# Altium schematic sheet 直流无刷电机V2.0.SchDoc
size A3
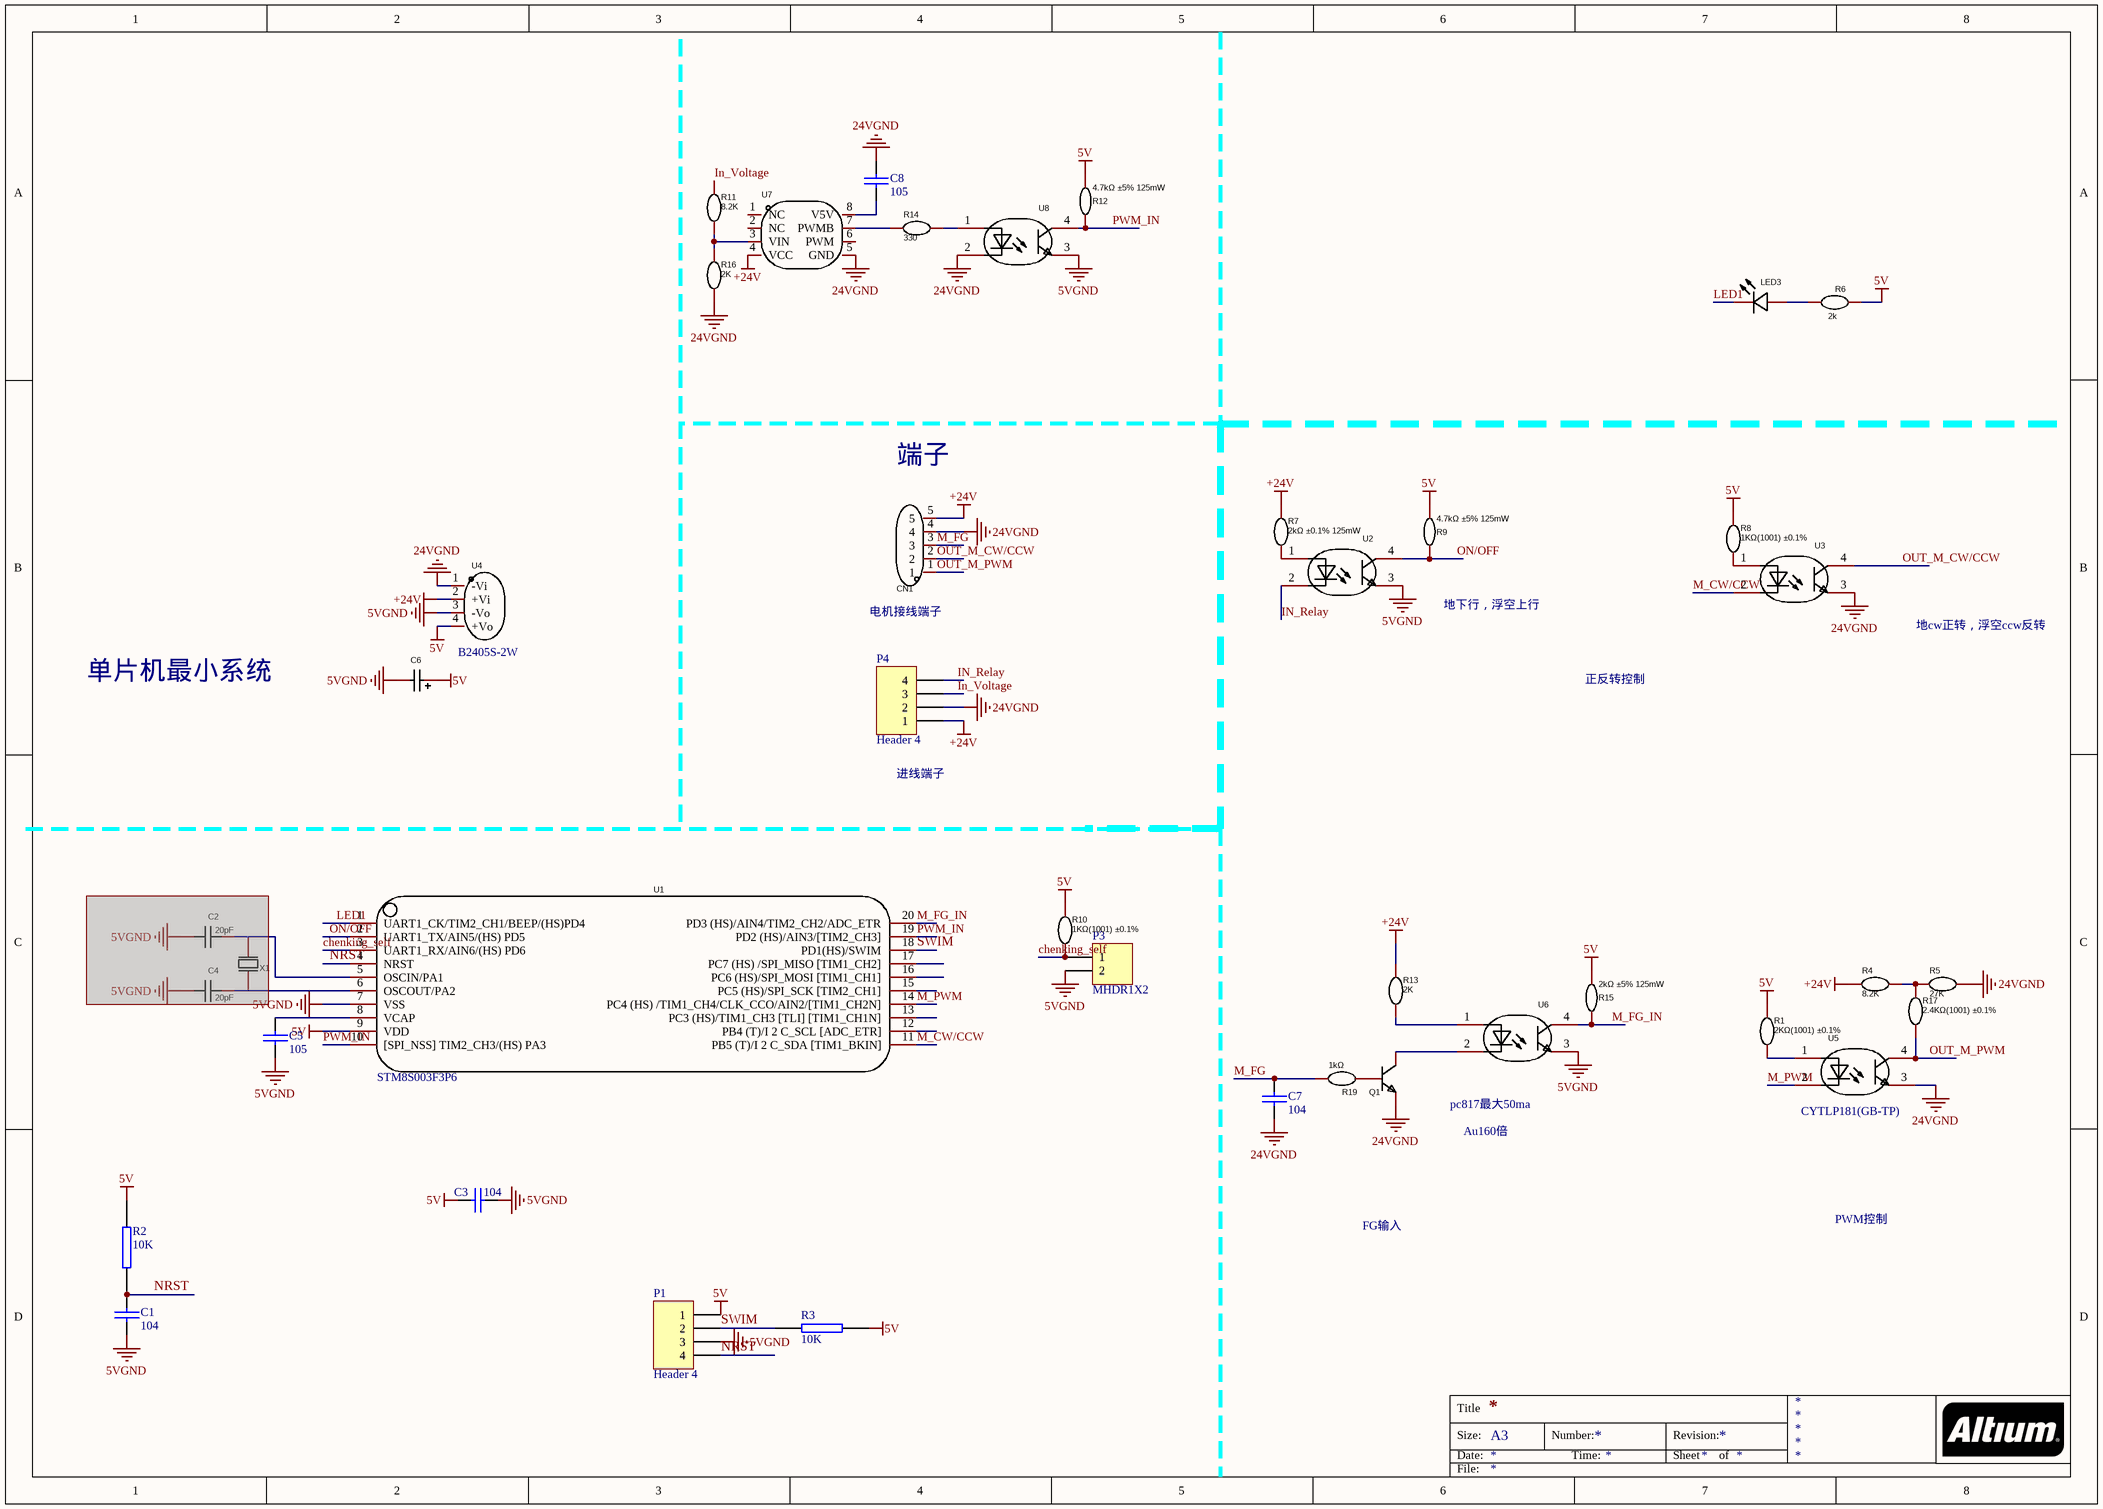
[diagram p0: 直流无刷电机V2.0.SchDoc]

## Parts
C1  104  [C0805]
C2  value 20pF  [C0805]  (hidden comment: 0805CG200J500NT)  (masked out: inside a compile mask, not in the netlist)
C3  104  [C0805]
C4  value 20pF  [C0805]  (hidden comment: 0805CG200J500NT)  (masked out: inside a compile mask, not in the netlist)
C5  105  [C0805]
C6  CA45-B010K476T  [CAP-SMD_L3.5-W2.8-R-RD]  (value not drawn)
C7  104  [C0805]
C8  105  [C0805]
CN1  DB2EVC-2.54-5P-GN  [CONN-TH_5P-P2.54_DIBO_DB2EVC-2.54-5P-GN]  (value not drawn)
LED3  17-21/R6C-AQ2R2B/3T  [LED0805-R-RD]  (value not drawn)
P1  Header 4  [HDR1X4]
P3  MHDR1X2  [MHDR1X2]
P4  Header 4  [CONN-TH_XY340V-3.81-3P]
Q1  BC817_C2137  [SOT-23-3_L2.9-W1.3-P1.90-LS2.4-BR]  (value not drawn)
R1  LCSC Part Name: 2KΩ(1001) ±0.1%  [R0805]  (hidden comment: ERJPB6B1001V)
R2  10K  [R0805]
R3  10K  [R0805]
R4  LCSC Part Name: 8.2K  [R0805]  (hidden comment: ERJPB6B1001V)
R5  LCSC Part Name: 27K  [R0805]  (hidden comment: ERJPB6B1001V)
R6  LCSC Part Name: 2k  [R0805]  (hidden comment: ERJPB6B1001V)
R7  LCSC Part Name: 2kΩ ±0.1% 125mW  [R0805]  (hidden comment: RN73H2ATTD2001B10)
R8  LCSC Part Name: 1KΩ(1001) ±0.1%  [R0805]  (hidden comment: ERJPB6B1001V)
R9  LCSC Part Name: 4.7kΩ ±5% 125mW  [R0805]  (hidden comment: RTT05472JTP)
R10  LCSC Part Name: 1KΩ(1001) ±0.1%  [R0805]  (hidden comment: ERJPB6B1001V)
R11  LCSC Part Name: 8.2K  [R0805]  (hidden comment: ERJPB6B1001V)
R12  LCSC Part Name: 4.7kΩ ±5% 125mW  [R0805]  (hidden comment: RTT05472JTP)
R13  LCSC Part Name: 2K  [R0805]  (hidden comment: ERJPB6B1001V)
R14  LCSC Part Name: 330  [R0805]  (hidden comment: RN73H2ATTD2001B10)
R15  LCSC Part Name: 2kΩ ±5% 125mW  [R0805]  (hidden comment: RTT05472JTP)
R16  LCSC Part Name: 2K  [R0805]  (hidden comment: ERJPB6B1001V)
R17  LCSC Part Name: 2.4KΩ(1001) ±0.1%  [R0805]  (hidden comment: ERJPB6B1001V)
R19  LCSC Part Name: 1kΩ  [R0805]  (hidden comment: 0805W8F8002T5E)
U1  STM8S003F3P6  [TSSOP-20_L6.5-W4.4-P0.65-LS6.4-BL]
U2  PC817C_C2936043  [SOP-4_L6.5-W4.6-P2.54-LS10.2-TL]  (value not drawn)
U3  PC817C_C2936043  [SOP-4_L6.5-W4.6-P2.54-LS10.2-TL]  (value not drawn)
U4  B2405S-2W  [PWRM-TH_B2405S-1WR2]
U5  CYTLP181(GB-TP)  [SOP-4_L3.9-W4.4-P2.54-LS7.0-BR]
U6  PC817C_C2936043  [SOP-4_L6.5-W4.6-P2.54-LS10.2-TL]  (value not drawn)
U7  GP9303-F500-N-SW  [SOP-8_L4.9-W3.9-P1.27-LS6.0-BL]  (value not drawn)
U8  PC817C_C2936043  [SOP-4_L6.5-W4.6-P2.54-LS10.2-TL]  (value not drawn)
X1  S1C80000ZWGAC  [HC-49S_L11.0-W4.7-P4.88]  (value not drawn)  (masked out: inside a compile mask, not in the netlist)

## Nets
5V: C3.1 C6.1 P1.1 R1.2 R2.1 R3.2 R6.2 R8.2 R9.2 R10.2 R12.2 R15.2 U1.9(VDD) U4.4(+Vo)
5VGND: C1.2 C3.2 C5.1 C6.2 P1.3 P3.2 U1.7(VSS) U2.3 U4.3(-Vo) U6.3 U8.3
24VGND: C7.1 C8.1 CN1.4 P4.2 Q1.2(E) R5.1 R16.1 U3.3 U4.1(-Vi) U5.3(EMI) U7.5(GND) U8.2
+24V: CN1.5 P4.1 R4.2 R7.2 R13.2 U4.2(+Vi) U7.4(VCC)
chenking_self: P3.1 R10.1 U1.3(UART1_RX/AIN6/(HS)_PD6)
IN_Relay: P4.4 U2.2
In_Voltage: P4.3 R11.2
LED1: LED3.1(K) U1.1(UART1_CK/TIM2_CH1/BEEP/(HS)PD4)
M_CW/CCW: U1.11(PB5_(T)/I_2_C_SDA_[TIM1_BKIN]) U3.2
M_FG: C7.2 CN1.3 R19.1
M_FG_IN: R15.1 U1.20(PD3_(HS)/AIN4/TIM2_CH2/ADC_ETR) U6.4
M_PWM: U1.14(PC4_(HS)_/TIM1_CH4/CLK_CCO/AIN2/[TIM1_CH2N]) U5.2(CAT)
NRST: C1.1 P1.4 R2.2 U1.4(NRST)
ON/OFF: R9.1 U1.2(UART1_TX/AIN5/(HS)_PD5) U2.4
OUT_M_CW/CCW: CN1.2 U3.4
OUT_M_PWM: CN1.1 R17.1 U5.4(COL)
PWM_IN: R12.1 U1.10([SPI_NSS]_TIM2_CH3/(HS)_PA3) U1.19(PD2_(HS)/AIN3/[TIM2_CH3]) U8.4
SWIM: P1.2 R3.1 U1.18(PD1(HS)/SWIM)
NetC5_2: C5.2 U1.8(VCAP)
NetC8_2: C8.2 U7.8(V5V)
NetLED3_2: LED3.2(A) R6.1
NetQ1_1: Q1.1(B) R19.2
NetQ1_3: Q1.3(C) U6.2
NetR1_1: R1.1 U5.1(AN)
NetR4_1: R4.1 R5.2 R17.2
NetR7_1: R7.1 U2.1
NetR8_1: R8.1 U3.1
NetR11_1: R11.1 R16.2 U7.3(VIN)
NetR13_1: R13.1 U6.1
NetR14_1: R14.1 U8.1
NetR14_2: R14.2 U7.7(PWMB)

Not connected (* = marked no-connect by the designer): U1 5(OSCIN/PA1) 6(OSCOUT/PA2) 12(PB4_(T)/I_2_C_SCL_[ADC_ETR]) 13(PC3_(HS)/TIM1_CH3_[TLI]_[TIM1_CH1N]) 15(PC5_(HS)/SPI_SCK_[TIM2_CH1]) 16(PC6_(HS)/SPI_MOSI_[TIM1_CH1]) 17(PC7_(HS)_/SPI_MISO_[TIM1_CH2]); U7 1(NC) 2(NC) 6(PWM)

## Notes on the sheet
- (near CN1) 端子
- (near CN1) 电机接线端子
- 地下行，浮空上行
- 地cw正转，浮空ccw反转
- 单片机最小系统
- 正反转控制
- (near P4) 进线端子
- pc817最大50ma
- Au160倍
- FG输入
- PWM控制
- Title
- Size:
- Date:
- A3
- Number:
- Time:
- Revision:
- Sheet
- of
- File:

## Library data of the parts
C1 C3 C5 C7 C8 = CAP: Capacitor
C2 C4 = 0805CG200J500NT: Manufacturer: FH(风华); Add into BOM: yes; Temperature Coefficient: C0G; Tolerance: ±5%; Voltage Rated: 50V; Name: 20pF; Symbol: 0805CG200J500NT; Device: 0805CG200J500NT; LCSC Part Name: 20pF(200) ±5% 50V; Supplier Part: C94472; Manufacturer Part: 0805CG200J500NT; Supplier Footprint: 0805; JLCPCB Part Class: Extended Part; Datasheet: https://atta.szlcsc.com/upload/public/pdf/source/20170923/C94472_1506149578159988997.pdf; Supplier: LCSC; Convert to PCB: yes
C6 = CA45-B010K476T: Manufacturer: 湘怡中元/湘江; Name: 47uF; Add into BOM: yes; Rated Voltage: 10V; Equivalent Series Resistance(ESR): 1Ω 100kHz; Value: 47uF; Tolerance: ±10%; Symbol: CA45-B010K476T; Device: CA45-B010K476T; LCSC Part Name: 47uF ±10% 10V; Supplier Part: C123253; Manufacturer Part: CA45-B010K476T; Supplier Footprint: CASE-B_3528; JLCPCB Part Class: Extended Part; Datasheet: https://atta.szlcsc.com/upload/public/pdf/source/20181017/C123253_E44F021CD80332E438026884F943F9F2.pdf; Supplier: LCSC; Convert to PCB: yes; Operating Temperature: -55℃~+125℃
CN1 = DB2EVC-2.54-5P-GN: Manufacturer: DIBO(地博电气); Add into BOM: yes; Connector Type: 板端/插座-闭口; Pitch: 2.54mm; Number of PINs Per Row: 5; Current Rating (Max): 5A; Voltage Rating (Max): 150V; Name: DB2EVC-2.54-5P-GN; Symbol: DB2EVC-2.54-5P-GN; Device: DB2EVC-2.54-5P-GN; LCSC Part Name: 板端/插座-闭口 2.54mm 排数:1 每排P数:5 直针; Supplier Part: C2927496; Manufacturer Part: DB2EVC-2.54-5P-GN; Supplier Footprint: 直插,P=2.54mm; JLCPCB Part Class: Extended Part; Datasheet: https://atta.szlcsc.com/upload/public/pdf/source/20211210/E15A577DC3E4D22CA3FDFA7356E87168.pdf; Supplier: LCSC; Convert to PCB: yes; Number of Rows: 1; Mounting Style: 直针; Contact Material: 铜合金; Contact Plating: 锡; Operating Temperature Range: -40℃~+105℃; Color: 绿色
LED3 = 17-21/R6C-AQ2R2B/3T: Manufacturer: EVERLIGHT(亿光); Add into BOM: yes; Illumination Color: 红色; Luminous Intensity (IF=20mA): 90~180mcd; Dominant Wavelength / Coordinate rank: 617.5~633.5nm; Name: 17-21/R6C-AQ2R2B/3T; Symbol: 17-21/R6C-AQ2R2B/3T; Device: 17-21/R6C-AQ2R2B/3T; LCSC Part Name: 17-21/R6C-AQ2R2B/3T; Supplier Part: C113551; Manufacturer Part: 17-21/R6C-AQ2R2B/3T; Supplier Footprint: 0805; JLCPCB Part Class: Extended Part; Datasheet: https://atta.szlcsc.com/upload/public/pdf/source/20170914/C113551_1505373979236968871.pdf; Supplier: LCSC; Convert to PCB: yes; Mounting Type: 表面贴装
P1 P4 = Header 4: Header, 4-Pin; LatestRevisionDate: 17-Jul-2002; LatestRevisionNote: Re-released for DXP Platform.; Publisher: Altium Limited
P3 = MHDR1X2: Header, 2-Pin; LatestRevisionDate: 17-Jul-2002; LatestRevisionNote: Re-released for DXP Platform.; Publisher: Altium Limited
Q1 = BC817_C2137: Manufacturer: CJ(江苏长电/长晶); Name: BC817; Symbol: BC817-16 6A; Add into BOM: yes; Transistor Type: NPN; Collector-Emitter Breakdown Voltage (Vceo): 45V; Collector Current (Ic): 500mA; Power Dissipation (Pd): 300mW; Collector Cut-Off Current (Icbo): 100nA; Collector-Emitter Saturation Voltage (VCE(sat)@Ic,Ib): 700mV@500mA,50mA; DC Current Gain (hFE@Ic,Vce): 100@100mA,1V; Transition Frequency (fT): 100MHz; Device: BC817_C2137; LCSC Part Name: NPN 45V 500mA; Supplier Part: C2137; Manufacturer Part: BC817; Supplier Footprint: SOT-23; JLCPCB Part Class: Extended Part; Datasheet: https://atta.szlcsc.com/upload/public/pdf/source/20140809/1457707208989.pdf; Supplier: LCSC; Convert to PCB: yes; Operating Temperature: +150℃@(Tj)
R1 R4-R6 R8 R10 R11 R13 R16 R17 = ERJPB6B1001V: Manufacturer: PANASONIC(松下); Add into BOM: yes; Name: ERJPB6B1001V; Symbol: ERJPB6B1001V; Device: ERJPB6B1001V; Supplier Part: C413712; Manufacturer Part: ERJPB6B1001V; Supplier Footprint: 0805; JLCPCB Part Class: Extended Part; Datasheet: https://atta.szlcsc.com/upload/public/pdf/source/20190821/C413712_16C6B59B4DECA51D4907C6F5D5BAEAA8.pdf; Supplier: LCSC; Convert to PCB: yes
R2 R3 = RES2
R7 R14 = RN73H2ATTD2001B10: Manufacturer: KOA; Name: 2kΩ; Add into BOM: yes; Value: 2kΩ; Tolerance: ±0.1%; Power(Watts): 125mW; Temperature Coefficient: ±10ppm/℃; Symbol: RN73H2ATTD2001B10; Device: RN73H2ATTD2001B10; Supplier Part: C782235; Manufacturer Part: RN73H2ATTD2001B10; Supplier Footprint: 0805; JLCPCB Part Class: Extended Part; Datasheet: https://atta.szlcsc.com/upload/public/pdf/source/20200909/C782235_A96C5D75DAB930F25D533550B4CBE346.pdf; Supplier: LCSC; Convert to PCB: yes
R9 R12 R15 = RTT05472JTP: Manufacturer: RALEC(旺诠); Name: 4.7kΩ; Add into BOM: yes; Value: 4.7kΩ; Tolerance: ±5%; Power(Watts): 125mW; Temperature Coefficient: ±100ppm/℃; Overload Voltage (Max): 150V; Symbol: RTT05472JTP; Device: RTT05472JTP; Supplier Part: C104350; Manufacturer Part: RTT05472JTP; Supplier Footprint: 0805; JLCPCB Part Class: Extended Part; Datasheet: https://atta.szlcsc.com/upload/public/pdf/source/20170408/1491646559888.pdf; Supplier: LCSC; Convert to PCB: yes; Type: 厚膜电阻; Operating Temperature Range: -55℃~+155℃
R19 = 0805W8F8002T5E: Manufacturer: UNI-ROYAL(厚声); Name: 80kΩ; Add into BOM: yes; Value: 80kΩ; Tolerance: ±1%; Power(Watts): 125mW; Temperature Coefficient: ±100ppm/℃; Overload Voltage (Max): 150V; Symbol: 0805W8F8002T5E; Device: 0805W8F8002T5E; Supplier Part: C2767534; Manufacturer Part: 0805W8F8002T5E; Supplier Footprint: 0805; JLCPCB Part Class: Extended Part; Datasheet: https://atta.szlcsc.com/upload/public/pdf/source/20200306/C422600_1E6D84923E4A46A82E41ADD87F860B5C.pdf; Supplier: LCSC; Convert to PCB: yes; Type: 厚膜电阻; Operating Temperature Range: -55℃~+155℃
U1 = STM8S003F3P6: Manufacturer: ST(意法半导体); Add into BOM: yes; Name: STM8S003F3P6; Symbol: STM8S003F3P6; Device: STM8S003F3P6; LCSC Part Name: STM8S003F3P6; Supplier Part: C18615; Manufacturer Part: STM8S003F3P6; Supplier Footprint: TSSOP-20; JLCPCB Part Class: Extended Part; Datasheet: https://atta.szlcsc.com/upload/public/pdf/source/20130903/1457706644298.pdf; Supplier: LCSC; Convert to PCB: yes
U2 U3 U6 U8 = PC817C_C2936043: Manufacturer: Slkor(萨科微); Name: PC817C; Add into BOM: yes; Input voltage type: DC; Output Type: 光电三极管; Number of Outputs: 1; Forward Voltage: 1.2V; Reverse Voltage: 6V; Output Current: 50mA; Receiving End Voltage: 70V; Collector-Emitter Saturation Voltage (Vce(sat)@Ic,IF): 100mV@1mA,20mA; Rise time: 4us@2mA,100Ω; Fall time: 3us@2mA,100Ω; Isolation Voltage(rms): 5kV; Symbol: PC817C_C2936043; Device: PC817C_C2936043; LCSC Part Name: PC817C; Supplier Part: C2936043; Manufacturer Part: PC817C; Supplier Footprint: SOP-4-2.54mm; JLCPCB Part Class: Extended Part; Datasheet: https://atta.szlcsc.com/upload/public/pdf/source/20211223/F034BA3A35BFF661DF174E965ECEB7BD.pdf; Supplier: LCSC; Convert to PCB: yes; Operating Temperature: -40℃~+100℃
U4 = B2405S-1W_C3345180: Manufacturer: NYBOXING(尼博星); Add into BOM: yes; Output Channel: 1; Input Voltage(DC): 21.6V~26.4V; Output Voltage: 5V; Output Power: 1W; Insulated Voltage: 1kV; Name: B2405S-1W; Symbol: B2405S-1W_C3345180; Device: B2405S-1W_C3345180; LCSC Part Name: 电源模块 模块电源 dcdc模块 24V转5V 1W 隔离模块; Supplier Part: C3345180; Manufacturer Part: B2405S-1W; Supplier Footprint: 插件; JLCPCB Part Class: Extended Part; Datasheet: https://atta.szlcsc.com/upload/public/pdf/source/20220704/F96432D0D6BB557B5DEFFC115F2CECD6.pdf; Supplier: LCSC; Convert to PCB: yes
U5 = CYTLP181(GB-TP): Manufacturer: OCIC(卓睿); Symbol: CYTLP181(GB-TP2); Add into BOM: yes; Name: CYTLP181(GB-TP); Device: CYTLP181(GB-TP); LCSC Part Name: CYTLP181(GB-TP); Supplier Part: C385054; Manufacturer Part: CYTLP181(GB-TP); Supplier Footprint: SOP-4_2.54; JLCPCB Part Class: Extended Part; Datasheet: https://atta.szlcsc.com/upload/public/pdf/source/20190506/C385054_FAE23A869392FC5336AA394252D11801.pdf; Supplier: LCSC; Convert to PCB: yes; Product Type: -; Input Type: -; Number of Channels: -; Voltage-Isolation: -; Output-Voltage(Max): -; Output-Current(Max): -; Data Rate: -; Voltage-Supply: -
U7 = GP9303-F500-N-SW: Manufacturer: Guestgood(客益); Add into BOM: yes; Name: GP9303-F500-N-SW; Symbol: GP9303-F500-N-SW; Device: GP9303-F500-N-SW; LCSC Part Name: 数据转换器ADC; Supplier Part: C5464824; Manufacturer Part: GP9303-F500-N-SW; Supplier Footprint: SOP-8; Datasheet: https://atta.szlcsc.com/upload/public/pdf/source/20230506/4302C737F1DBCCB9206A6988B2EC2060.pdf; Supplier: LCSC; Convert to PCB: yes
X1 = S1C80000ZWGAC: Manufacturer: JYJE(晶友嘉); Name: 8MHz; Add into BOM: yes; Crystal Type: 直插无源晶振; Value: 8MHz; Frequency Tolerance: ±20ppm; Frequency Stability: ±30ppm; Load Capacitance: 20pF; Equivalent Series Resistance (ESR): 60Ω; Symbol: S1C80000ZWGAC; Device: S1C80000ZWGAC; LCSC Part Name: 8MHz ±20ppm 20pF; Supplier Part: C2929685; Manufacturer Part: S1C80000ZWGAC; Supplier Footprint: HC-49S; JLCPCB Part Class: Extended Part; Datasheet: https://atta.szlcsc.com/upload/public/pdf/source/20211213/D374FEC0EDCCBD098E5F362AD0579675.pdf; Supplier: LCSC; Convert to PCB: yes; Operating Temperature: -40℃~+85℃